# Altium schematic sheet ETH.SchDoc
size A4; SheetNumber: 9; SheetTotal: 12
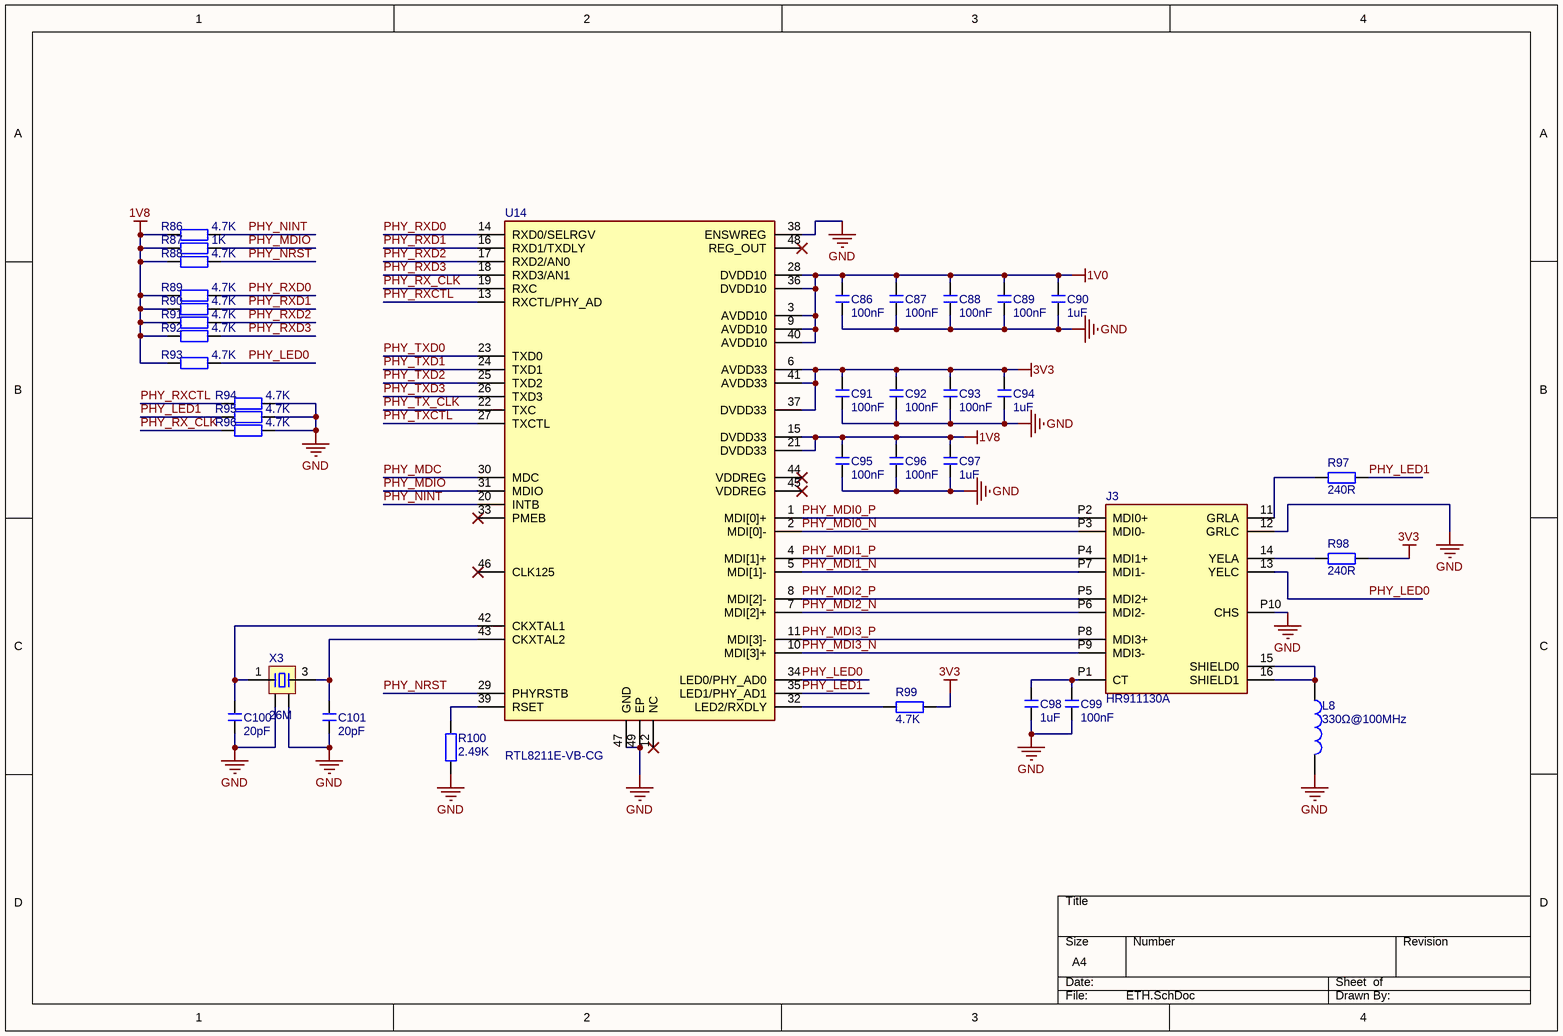
[diagram p0: ETH.SchDoc]

## Parts
C86  100nF  [C 0402_L]
C87  100nF  [C 0402_L]
C88  100nF  [C 0402_L]
C89  100nF  [C 0402_L]
C90  1uF  [C 0402_L]
C91  100nF  [C 0402_L]
C92  100nF  [C 0402_L]
C93  100nF  [C 0402_L]
C94  1uF  [C 0402_L]
C95  100nF  [C 0402_L]
C96  100nF  [C 0402_L]
C97  1uF  [C 0402_L]
C98  1uF  [C 0402_L]
C99  100nF  [C 0402_L]
C100  20pF  [C 0805_L]
C101  20pF  [C 0805_L]
J3  HR911130A  [HR911130A]
L8  330Ω@100MHz  [L 0805]
R86  4.7K  [R 0402_L]
R87  1K  [R 0402_L]
R88  4.7K  [R 0402_L]
R89  4.7K  [R 0402_L]
R90  4.7K  [R 0402_L]
R91  4.7K  [R 0402_L]
R92  4.7K  [R 0402_L]
R93  4.7K  [R 0402_L]
R94  4.7K  [R 0402_L]
R95  4.7K  [R 0402_L]
R96  4.7K  [R 0402_L]
R97  240R  [R 0805_L]
R98  240R  [R 0805_L]
R99  4.7K  [R 0402_L]
R100  2.49K  [R 0402_L]
U14  RTL8211E-VB-CG  [QFN48 7X7_L]
X3  26M  [OSC 1612-4P]

## Nets
1V0: C86.2 C87.2 C88.2 C89.2 C90.2 U14.3(AVDD10) U14.9(AVDD10) U14.28(DVDD10) U14.36(DVDD10) U14.40(AVDD10)
1V8: C95.2 C96.2 C97.2 R86.2 R87.2 R88.2 R89.2 R90.2 R91.2 R92.2 R93.2 U14.15(DVDD33) U14.21(DVDD33)
3V3: C91.2 C92.2 C93.2 C94.2 R98.1 R99.1 U14.6(AVDD33) U14.37(DVDD33) U14.41(AVDD33)
GND: C86.1 C87.1 C88.1 C89.1 C90.1 C91.1 C92.1 C93.1 C94.1 C95.1 C96.1 C97.1 C98.1 C99.1 C100.1 C101.1 J3.12(GRLC) J3.P10(CHS) L8.2 R94.1 R95.1 R96.1 R100.1 U14.38(ENSWREG) U14.47(GND) U14.49(EP) X3.2 X3.4
PHY_LED0: J3.13(YELC) R93.1 U14.34(LED0/PHY_AD0)
PHY_LED1: R95.2 R97.1 U14.35(LED1/PHY_AD1)
PHY_MDC: U14.30(MDC)
PHY_MDI0_N: J3.P3(MDI0-) U14.2(MDI[0]-)
PHY_MDI0_P: J3.P2(MDI0+) U14.1(MDI[0]+)
PHY_MDI1_N: J3.P7(MDI1-) U14.5(MDI[1]-)
PHY_MDI1_P: J3.P4(MDI1+) U14.4(MDI[1]+)
PHY_MDI2_N: J3.P6(MDI2-) U14.7(MDI[2]+)
PHY_MDI2_P: J3.P5(MDI2+) U14.8(MDI[2]-)
PHY_MDI3_N: J3.P9(MDI3-) U14.10(MDI[3]+)
PHY_MDI3_P: J3.P8(MDI3+) U14.11(MDI[3]-)
PHY_MDIO: R87.1 U14.31(MDIO)
PHY_NINT: R86.1 U14.20(INTB)
PHY_NRST: R88.1 U14.29(PHYRSTB)
PHY_RX_CLK: R96.2 U14.19(RXC)
PHY_RXCTL: R94.2 U14.13(RXCTL/PHY_AD)
PHY_RXD0: R89.1 U14.14(RXD0/SELRGV)
PHY_RXD1: R90.1 U14.16(RXD1/TXDLY)
PHY_RXD2: R91.1 U14.17(RXD2/AN0)
PHY_RXD3: R92.1 U14.18(RXD3/AN1)
PHY_TX_CLK: U14.22(TXC)
PHY_TXCTL: U14.27(TXCTL)
PHY_TXD0: U14.23(TXD0)
PHY_TXD1: U14.24(TXD1)
PHY_TXD2: U14.25(TXD2)
PHY_TXD3: U14.26(TXD3)
NetC98_2: C98.2 C99.2 J3.P1(CT)
NetC100_2: C100.2 U14.42(CKXTAL1) X3.1
NetC101_2: C101.2 U14.43(CKXTAL2) X3.3
NetJ3_11: J3.11(GRLA) R97.2
NetJ3_14: J3.14(YELA) R98.2
NetJ3_15: J3.15(SHIELD0) J3.16(SHIELD1) L8.1
NetR99_2: R99.2 U14.32(LED2/RXDLY)
NetR100_2: R100.2 U14.39(RSET)

Not connected (* = marked no-connect by the designer): U14 12(NC)* 33(PMEB)* 44(VDDREG)* 45(VDDREG)* 46(CLK125)* 48(REG_OUT)*

## Library data of the parts
C86-C101 = C: 无极性贴片电容; 版权归属: 源创客; BOM名称: 无极性贴片电容; 学习资源: www.ooocke.com
J3 = HR911130A: 千兆以太网带变压器; Manufacturer_Name: Hanrun Electronics; Datasheet Link: https://datasheet.lcsc.com/szlcsc/Zhongshan-HanRun-Elec-HR911130A_C54408.pdf; Height: 13mm; Manufacturer_Part_Number: HR911130A
L8 = L: 小功率贴片电感; 版权归属: 源创客; BOM名称: 小功率贴片电感; 学习资源: www.ooocke.com
R86-R100 = R: 贴片电阻; 版权归属: 源创客; BOM名称: 贴片电阻; 学习资源: www.ooocke.com
U14 = RTL8211E-VB-CG: 以太网芯片; Manufacturer_Name: Realtek; Datasheet Link: http://download3.dvd-driver.cz/realtek/datasheets/pdf/rtl8211e(g)-vb(vl)-cg_datasheet_1.6.pdf; Height: 1mm; Manufacturer_Part_Number: RTL8211E-VB-CG
X3 = XTAL-4P: 4脚无源晶振; 版权归属: 源创客; BOM名称: 4脚无源晶振; 学习资源: www.ooocke.com